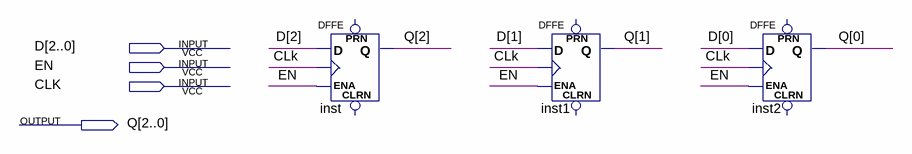
[diagram p0: schematic sheet]
// Quartus schematic DFF_3bit.bdf as structural Verilog: 3 symbols, 4 pins
module DFF_3bit (
  input  [2:0] D,
  input  EN,
  input  CLK,
  output [2:0] Q
);

  DFFE inst (.D(D[2]), .CLK(CLK), .ENA(EN), .Q(Q[2]));  // open: PRN, CLRN
  DFFE inst1 (.D(D[1]), .CLK(CLK), .ENA(EN), .Q(Q[1]));  // open: PRN, CLRN
  DFFE inst2 (.D(D[0]), .CLK(CLK), .ENA(EN), .Q(Q[0]));  // open: PRN, CLRN
endmodule
